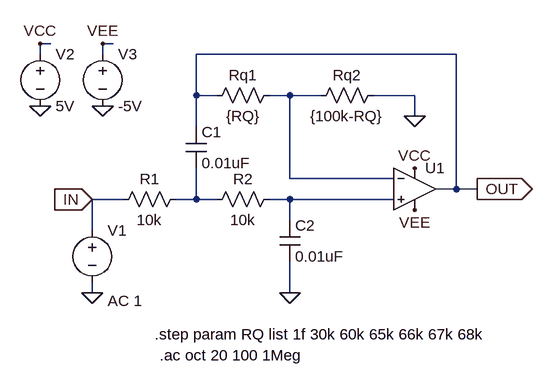
[diagram p0: schematic VCVS Q-control.asc]
VCVS Q-control.asc, the LTspice schematic file:
Version 4
SHEET 1 1244 680
WIRE -128 -208 -144 -208
WIRE -32 -208 -48 -208
WIRE -144 -192 -144 -208
WIRE -48 -192 -48 -208
WIRE 496 -192 96 -192
WIRE 96 -128 96 -192
WIRE 128 -128 96 -128
WIRE 240 -128 208 -128
WIRE 288 -128 240 -128
WIRE 432 -128 368 -128
WIRE 432 -96 432 -128
WIRE 96 -80 96 -128
WIRE 240 0 240 -128
WIRE 400 0 240 0
WIRE 496 16 496 -192
WIRE 496 16 464 16
WIRE 528 16 496 16
WIRE -16 32 -64 32
WIRE 96 32 96 -16
WIRE 96 32 64 32
WIRE 128 32 96 32
WIRE 240 32 208 32
WIRE 400 32 240 32
WIRE 240 64 240 32
WIRE -64 80 -64 32
WIRE -64 176 -64 160
WIRE 240 176 240 128
FLAG -64 176 0
FLAG 240 176 0
FLAG 432 -16 VCC
FLAG 432 48 VEE
FLAG 528 16 OUT
IOPIN 528 16 Out
FLAG 432 -96 0
FLAG -64 32 IN
IOPIN -64 32 In
FLAG -144 -112 0
FLAG -48 -112 0
FLAG -144 -208 VCC
FLAG -48 -208 VEE
SYMBOL voltage -64 64 R0
WINDOW 123 24 124 Left 2
WINDOW 39 0 0 Left 2
SYMATTR InstName V1
SYMATTR Value ""
SYMATTR Value2 AC 1
SYMBOL Opamps\\UniversalOpamp2 432 16 R0
SYMATTR InstName U1
SYMBOL res 80 16 R90
WINDOW 0 0 56 VBottom 2
WINDOW 3 32 56 VTop 2
SYMATTR InstName R1
SYMATTR Value 10k
SYMBOL res 224 16 R90
WINDOW 0 0 56 VBottom 2
WINDOW 3 32 56 VTop 2
SYMATTR InstName R2
SYMATTR Value 10k
SYMBOL cap 80 -80 R0
SYMATTR InstName C1
SYMATTR Value 0.01uF
SYMBOL cap 224 64 R0
SYMATTR InstName C2
SYMATTR Value 0.01uF
SYMBOL res 384 -144 R90
WINDOW 0 0 56 VBottom 2
WINDOW 3 32 56 VTop 2
SYMATTR InstName Rq2
SYMATTR Value {100k-RQ}
SYMBOL res 224 -144 R90
WINDOW 0 0 56 VBottom 2
WINDOW 3 32 56 VTop 2
SYMATTR InstName Rq1
SYMATTR Value {RQ}
SYMBOL voltage -144 -208 R0
SYMATTR InstName V2
SYMATTR Value 5V
SYMBOL voltage -48 -208 R0
SYMATTR InstName V3
SYMATTR Value -5V
TEXT 32 240 Left 2 !.step param RQ list 1f 30k 60k 65k 66k 67k 68k
TEXT 40 272 Left 2 !.ac oct 20 100 1Meg

The netlist it stands for:
* VCVS Q-control.asc
V1 IN 0 AC 1
XU1 N003 N001 VCC VEE OUT level.2 Avol=1Meg GBW=10Meg Slew=10Meg ilimit=25m rail=0 Vos=0 phimargin=45 en=0 enk=0 in=0 ink=0 Rin=500Meg  ; pins IN+ IN- V+ V- OUT
R1 N002 IN 10k
R2 N003 N002 10k
C1 OUT N002 0.01uF
C2 N003 0 0.01uF
Rq2 0 N001 {100k-RQ}
Rq1 N001 OUT {RQ}
V2 VCC 0 5V
V3 VEE 0 -5V
.step param RQ list 1f 30k 60k 65k 66k 67k 68k
.ac oct 20 100 1Meg
.lib UniversalOpamps2.sub
.backanno
.end